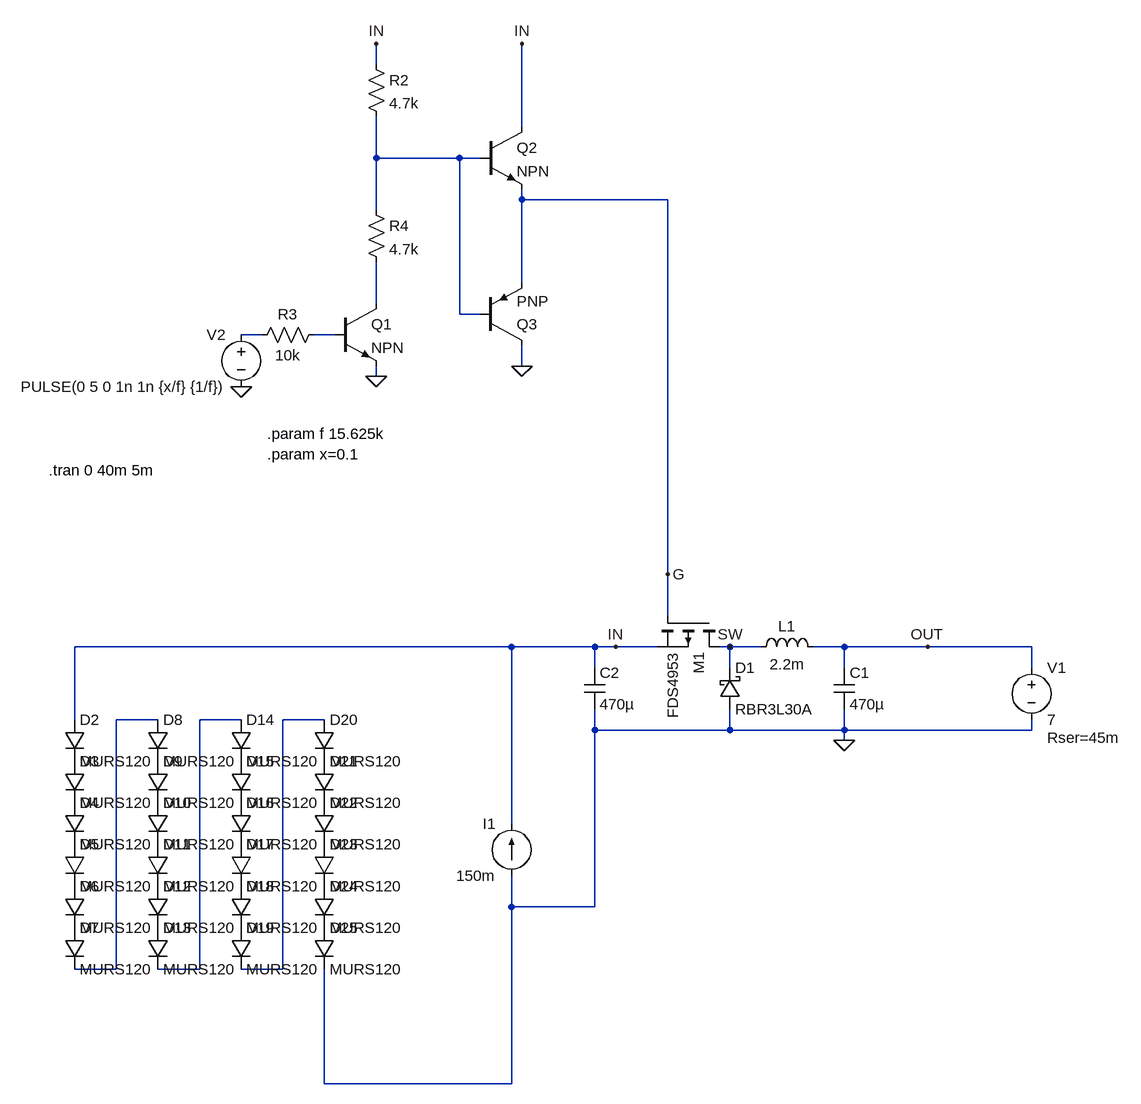
[diagram p0: schematic Schaltregler.asc]
Schaltregler.asc, the LTspice schematic file:
Version 4
SHEET 1 1236 1124
WIRE -400 -816 -400 -848
WIRE -176 -720 -176 -848
WIRE -400 -672 -400 -736
WIRE -272 -672 -400 -672
WIRE -240 -672 -272 -672
WIRE -176 -608 -176 -624
WIRE 48 -608 -176 -608
WIRE -400 -592 -400 -672
WIRE -176 -480 -176 -608
WIRE -400 -448 -400 -512
WIRE -272 -432 -272 -672
WIRE -240 -432 -272 -432
WIRE -576 -400 -608 -400
WIRE -464 -400 -496 -400
WIRE -176 -352 -176 -384
WIRE -400 -336 -400 -352
WIRE 48 -32 48 -608
WIRE 48 32 48 -32
WIRE -192 80 -864 80
WIRE -64 80 -192 80
WIRE -32 80 -64 80
WIRE 32 80 -32 80
WIRE 144 80 128 80
WIRE 192 80 144 80
WIRE 320 80 272 80
WIRE 448 80 320 80
WIRE 608 80 448 80
WIRE -64 112 -64 80
WIRE 144 112 144 80
WIRE 320 112 320 80
WIRE 608 112 608 80
WIRE -864 192 -864 80
WIRE -736 192 -800 192
WIRE -608 192 -672 192
WIRE -480 192 -544 192
WIRE -64 208 -64 176
WIRE 144 208 144 176
WIRE 144 208 -64 208
WIRE 320 208 320 176
WIRE 320 208 144 208
WIRE 608 208 608 192
WIRE 608 208 320 208
WIRE 320 224 320 208
WIRE -192 352 -192 80
WIRE -192 480 -192 432
WIRE -64 480 -64 208
WIRE -64 480 -192 480
WIRE -800 576 -800 192
WIRE -800 576 -864 576
WIRE -672 576 -672 192
WIRE -672 576 -736 576
WIRE -544 576 -544 192
WIRE -544 576 -608 576
WIRE -480 752 -480 576
WIRE -192 752 -192 480
WIRE -192 752 -480 752
FLAG -32 80 IN
FLAG 448 80 OUT
FLAG 320 224 0
FLAG -608 -320 0
FLAG -400 -336 0
FLAG 48 -32 G
FLAG -400 -848 IN
FLAG -176 -352 0
FLAG -176 -848 IN
FLAG 144 80 SW
SYMBOL cap 304 112 R0
SYMATTR InstName C1
SYMATTR Value 470µ
SYMBOL schottky 128 176 M180
WINDOW 0 24 64 Left 2
WINDOW 3 24 0 Left 2
SYMATTR InstName D1
SYMATTR Value RBR3L30A
SYMATTR Description Diode
SYMATTR Type diode
SYMBOL ind 176 96 R270
WINDOW 0 32 56 VTop 2
WINDOW 3 5 56 VBottom 2
SYMATTR InstName L1
SYMATTR Value 2.2m
SYMATTR SpiceLine Rser=649m
SYMBOL voltage -608 -416 M0
WINDOW 123 0 0 Left 2
WINDOW 39 0 0 Left 2
SYMATTR InstName V2
SYMATTR Value PULSE(0 5 0 1n 1n {x/f} {1/f})
SYMBOL pmos 128 32 R90
SYMATTR InstName M1
SYMATTR Value FDS4953
SYMBOL res -416 -832 R0
SYMATTR InstName R2
SYMATTR Value 4.7k
SYMBOL npn -464 -448 R0
SYMATTR InstName Q1
SYMBOL res -480 -416 R90
WINDOW 0 0 56 VBottom 2
WINDOW 3 32 56 VTop 2
SYMATTR InstName R3
SYMATTR Value 10k
SYMBOL npn -240 -720 R0
SYMATTR InstName Q2
SYMBOL pnp -240 -384 M180
SYMATTR InstName Q3
SYMBOL res -416 -608 R0
SYMATTR InstName R4
SYMATTR Value 4.7k
SYMBOL diode -880 192 R0
SYMATTR InstName D2
SYMATTR Value MURS120
SYMBOL diode -880 256 R0
SYMATTR InstName D3
SYMATTR Value MURS120
SYMBOL diode -880 320 R0
SYMATTR InstName D4
SYMATTR Value MURS120
SYMBOL diode -880 384 R0
SYMATTR InstName D5
SYMATTR Value MURS120
SYMBOL diode -880 448 R0
SYMATTR InstName D6
SYMATTR Value MURS120
SYMBOL diode -880 512 R0
SYMATTR InstName D7
SYMATTR Value MURS120
SYMBOL diode -752 192 R0
SYMATTR InstName D8
SYMATTR Value MURS120
SYMBOL diode -752 256 R0
SYMATTR InstName D9
SYMATTR Value MURS120
SYMBOL diode -752 320 R0
SYMATTR InstName D10
SYMATTR Value MURS120
SYMBOL diode -752 384 R0
SYMATTR InstName D11
SYMATTR Value MURS120
SYMBOL diode -752 448 R0
SYMATTR InstName D12
SYMATTR Value MURS120
SYMBOL diode -752 512 R0
SYMATTR InstName D13
SYMATTR Value MURS120
SYMBOL diode -624 192 R0
SYMATTR InstName D14
SYMATTR Value MURS120
SYMBOL diode -624 256 R0
SYMATTR InstName D15
SYMATTR Value MURS120
SYMBOL diode -624 320 R0
SYMATTR InstName D16
SYMATTR Value MURS120
SYMBOL diode -624 384 R0
SYMATTR InstName D17
SYMATTR Value MURS120
SYMBOL diode -624 448 R0
SYMATTR InstName D18
SYMATTR Value MURS120
SYMBOL diode -624 512 R0
SYMATTR InstName D19
SYMATTR Value MURS120
SYMBOL diode -496 192 R0
SYMATTR InstName D20
SYMATTR Value MURS120
SYMBOL diode -496 256 R0
SYMATTR InstName D21
SYMATTR Value MURS120
SYMBOL diode -496 320 R0
SYMATTR InstName D22
SYMATTR Value MURS120
SYMBOL diode -496 384 R0
SYMATTR InstName D23
SYMATTR Value MURS120
SYMBOL diode -496 448 R0
SYMATTR InstName D24
SYMATTR Value MURS120
SYMBOL diode -496 512 R0
SYMATTR InstName D25
SYMATTR Value MURS120
SYMBOL current -192 432 R180
WINDOW 0 24 80 Left 2
WINDOW 3 24 0 Left 2
WINDOW 123 0 0 Left 2
WINDOW 39 0 0 Left 2
SYMATTR InstName I1
SYMATTR Value 150m
SYMBOL cap -80 112 R0
SYMATTR InstName C2
SYMATTR Value 470µ
SYMBOL voltage 608 96 R0
WINDOW 123 0 0 Left 0
WINDOW 39 24 124 Left 2
SYMATTR InstName V1
SYMATTR Value 7
SYMATTR SpiceLine Rser=45m
TEXT -568 -248 Left 2 !.param f 15.625k
TEXT -568 -216 Left 2 !.param x=0.1
TEXT -904 -192 Left 2 !.tran 0 40m 5m

The netlist it stands for:
* Schaltregler.asc
C1 OUT 0 470µ
D1 0 SW RBR3L30A
L1 SW OUT 2.2m Rser=649m
V2 N003 0 PULSE(0 5 0 1n 1n {x/f} {1/f})
M1 SW G IN IN FDS4953
R2 IN N001 4.7k
Q1 N002 N004 0 0 NPN
R3 N004 N003 10k
Q2 IN N001 G 0 NPN
Q3 0 N001 G 0 PNP
R4 N001 N002 4.7k
D2 IN P001 MURS120
D3 P001 P002 MURS120
D4 P002 P003 MURS120
D5 P003 P004 MURS120
D6 P004 P005 MURS120
D7 P005 N005 MURS120
D8 N005 P006 MURS120
D9 P006 P007 MURS120
D10 P007 P008 MURS120
D11 P008 P009 MURS120
D12 P009 P010 MURS120
D13 P010 N006 MURS120
D14 N006 P011 MURS120
D15 P011 P012 MURS120
D16 P012 P013 MURS120
D17 P013 P014 MURS120
D18 P014 P015 MURS120
D19 P015 N007 MURS120
D20 N007 P016 MURS120
D21 P016 P017 MURS120
D22 P017 P018 MURS120
D23 P018 P019 MURS120
D24 P019 P020 MURS120
D25 P020 0 MURS120
I1 0 IN 150m
C2 IN 0 470µ
V1 OUT 0 7 Rser=45m
.model D D
.lib standard.dio
.model NPN NPN
.model PNP PNP
.lib standard.bjt
.model NMOS NMOS
.model PMOS PMOS
.lib standard.mos
.param f 15.625k
.param x=0.1
.tran 0 40m 5m
.backanno
.end